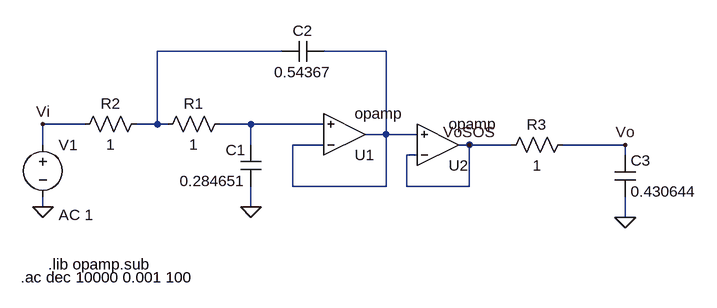
[diagram p0: schematic ts4_bessel_norm.asc]
ts4_bessel_norm.asc, the LTspice schematic file:
Version 4
SHEET 1 880 680
WIRE 144 0 -48 0
WIRE 304 0 208 0
WIRE -160 112 -224 112
WIRE -48 112 -48 0
WIRE -48 112 -80 112
WIRE -32 112 -48 112
WIRE 96 112 48 112
WIRE 208 112 96 112
WIRE 304 128 304 0
WIRE 304 128 272 128
WIRE 352 128 304 128
WIRE -224 144 -224 112
WIRE 96 144 96 112
WIRE 208 144 160 144
WIRE 432 144 416 144
WIRE 496 144 432 144
WIRE 672 144 576 144
WIRE 352 160 336 160
WIRE 672 160 672 144
WIRE 160 208 160 144
WIRE 304 208 304 128
WIRE 304 208 160 208
WIRE 336 208 336 160
WIRE 432 208 432 144
WIRE 432 208 336 208
WIRE -224 240 -224 224
WIRE 96 240 96 208
WIRE 672 256 672 224
FLAG 672 256 0
FLAG 96 240 0
FLAG -224 240 0
FLAG 672 144 Vo
FLAG -224 112 Vi
FLAG 432 144 VoSOS
SYMBOL Opamps\\opamp 240 192 M180
SYMATTR InstName U1
SYMBOL cap 208 -16 R90
WINDOW 0 0 32 VBottom 2
WINDOW 3 32 32 VTop 2
SYMATTR InstName C2
SYMATTR Value 0.54367
SYMBOL cap 112 208 R180
WINDOW 0 24 56 Left 2
WINDOW 3 24 8 Left 2
SYMATTR InstName C1
SYMATTR Value 0.284651
SYMBOL res 64 96 R90
WINDOW 0 0 56 VBottom 2
WINDOW 3 32 56 VTop 2
SYMATTR InstName R1
SYMATTR Value 1
SYMBOL res -64 96 R90
WINDOW 0 0 56 VBottom 2
WINDOW 3 32 56 VTop 2
SYMATTR InstName R2
SYMATTR Value 1
SYMBOL res 592 128 R90
WINDOW 0 0 56 VBottom 2
WINDOW 3 32 56 VTop 2
SYMATTR InstName R3
SYMATTR Value 1
SYMBOL cap 656 160 R0
SYMATTR InstName C3
SYMATTR Value 0.430644
SYMBOL voltage -224 128 R0
WINDOW 123 24 124 Left 2
WINDOW 39 0 0 Left 0
SYMATTR InstName V1
SYMATTR Value ""
SYMATTR Value2 AC 1
SYMBOL Opamps\\opamp 384 208 M180
SYMATTR InstName U2
TEXT -216 328 Left 2 !.lib opamp.sub
TEXT -258 348 Left 2 !.ac dec 10000 0.001 100

The netlist it stands for:
* ts4_bessel_norm.asc
XU1 N002 N003 N002 opamp Aol=100K GBW=10Meg  ; pins invin noninvin out
C2 N002 N001 0.54367
C1 0 N003 0.284651
R1 N003 N001 1
R2 N001 Vi 1
R3 Vo VoSOS 1
C3 Vo 0 0.430644
V1 Vi 0 AC 1
XU2 VoSOS N002 VoSOS opamp Aol=100K GBW=10Meg  ; pins invin noninvin out
.lib opamp.sub
.ac dec 10000 0.001 100
.backanno
.end